# Altium project DB_ADCS.PrjPcb
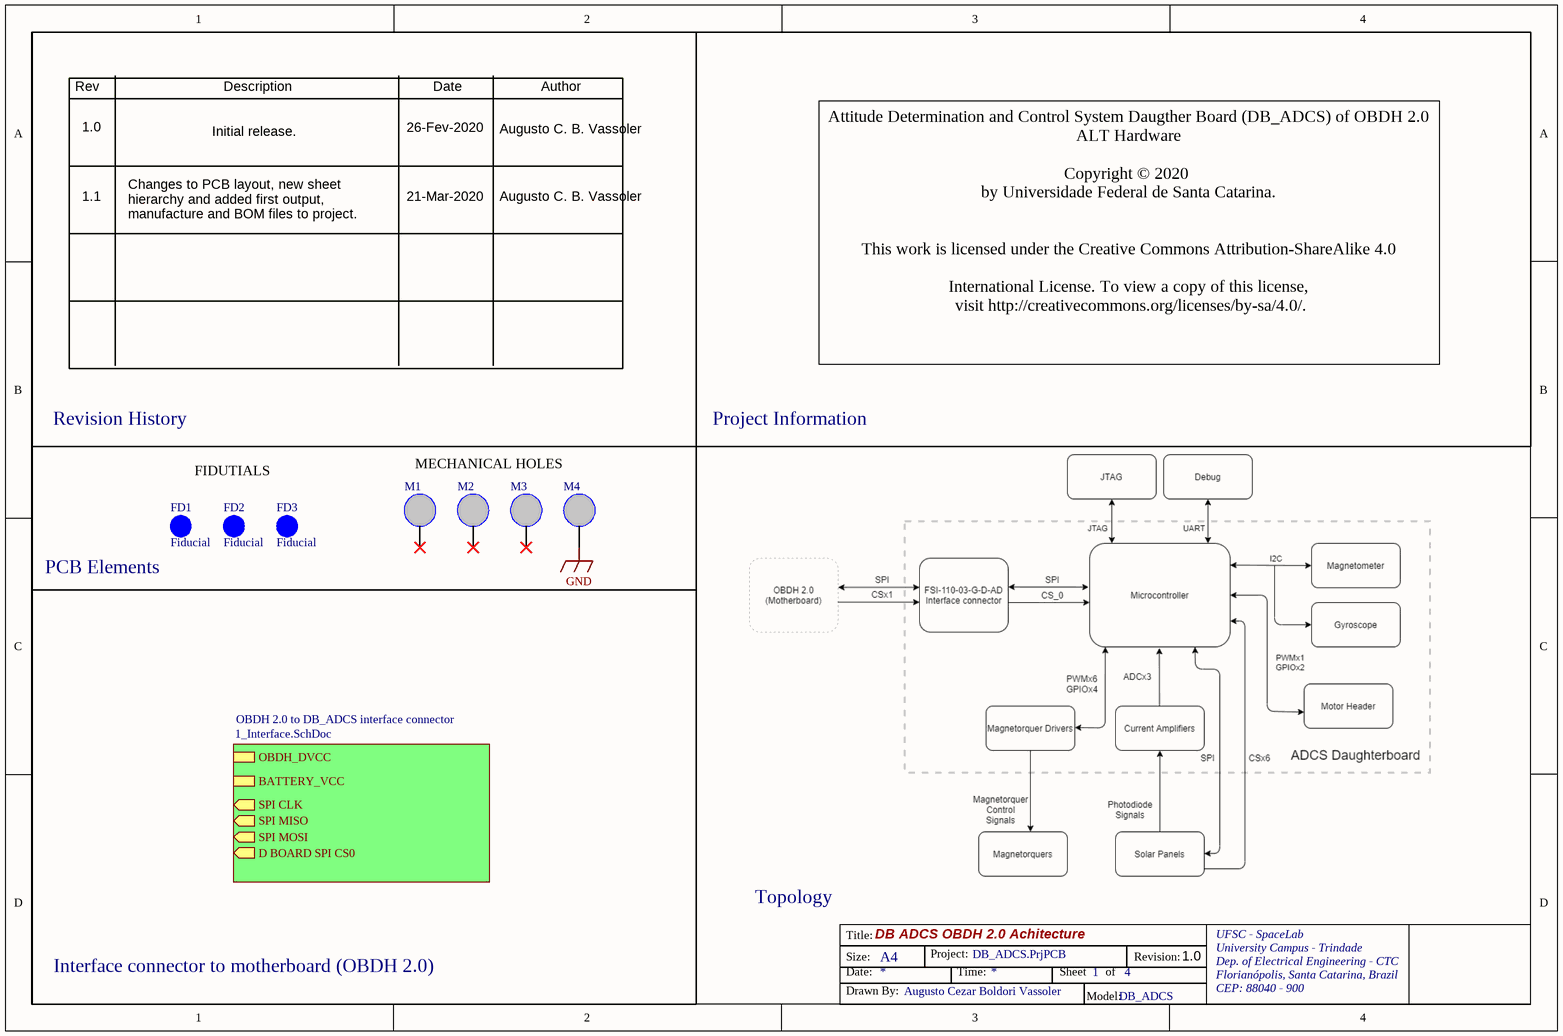
[diagram p0: 0_Architecture.SchDoc]
5 sheets, 84 parts. Net scope: hierarchical (ports join the sheet entries above them; power ports are global).
Board file: DB_ADCS.PcbDoc
Sheets:
  0_Architecture.SchDoc
    OBDH 2.0 to DB_ADCS interface connector = 1_Interface.SchDoc
  4_IMU.SchDoc
  5_Magnetorquer_Drivers.SchDoc
  6_Current_Sensing.SchDoc

## Sheet 0_Architecture.SchDoc
size A4; Organization: SpaceLab UFSC; Address1: UFSC - SpaceLab; Address2: University Campus - Trindade; Address3: Dep. of Electrical Engineering - CTC; Address4: Florianópolis, Santa Catarina, Brazil; Address5: CEP: 88040 - 900

### Parts
FD1  Fiducial  [Fiducial 1.3mm]
FD2  Fiducial  [Fiducial 1.3mm]
FD3  Fiducial  [Fiducial 1.3mm]
M1  DB Mechanical Hole  [DB Mechanical Hole]  (value not drawn)
M2  DB Mechanical Hole  [DB Mechanical Hole]  (value not drawn)
M3  DB Mechanical Hole  [DB Mechanical Hole]  (value not drawn)
M4  DB Mechanical Hole  [DB Mechanical Hole]  (value not drawn)

### Sub-sheets
OBDH 2.0 to DB_ADCS interface connector = 1_Interface.SchDoc: OBDH_DVCC, D BOARD SPI CS0 (out), SPI CLK (out), SPI MISO (out), SPI MOSI (out), BATTERY_VCC

### Nets
GND: M4.0

Not connected (* = marked no-connect by the designer): M1 0*; M2 0*; M3 0*

### Notes on the sheet
- Rev
- Description
- Date
- Author
- 1.0
- Initial release.
- 26-Fev-2020
- Augusto C. B. Vassoler
- 1.1
- Changes to PCB layout, new sheet hierarchy and added first output, manufacture and BOM files to project.
- 21-Mar-2020
- Attitude Determination and Control System Daugther Board (DB_ADCS) of OBDH 2.0 ALT Hardware
  Copyright © 2020
  by Universidade Federal de Santa Catarina.
  This work is licensed under the Creative Commons Attribution-ShareAlike 4.0
  International License. To view a copy of this license,
  visit http://creativecommons.org/licenses/by-sa/4.0/.
  - Drawn by: Augusto Cezar Boldori Vassoler.
  - Reviewers: André Martins Pio de Mattos and Gabriel Mariano Marcelino.
  - Based on OBDH 2.0 designed by: André Martins Pio de Mattos.
- Revision History
- Project Information
- FIDUTIALS
- MECHANICAL HOLES
- (near FD1) PCB Elements
- Topology
- Interface connector to motherboard (OBDH 2.0)
- DB ADCS OBDH 2.0 Achitecture
- DB_ADCS.PrjPCB
- 1
- 4
- Augusto Cezar Boldori Vassoler
- DB_ADCS
- Title:
- Size:
- Date:
- A4
- Project:
- Time:
- Sheet
- of
- Revision:
- UFSC - SpaceLab
- University Campus - Trindade
- Dep. of Electrical Engineering - CTC
- Florianópolis, Santa Catarina, Brazil
- CEP: 88040 - 900
- Drawn By:
- Model:

### Library data of the parts
FD1-FD3 = Fiducial: Fiducial for DB board variants
M1-M4 = DB Mechanical Hole: Mechanical Hole for DB board variants

## Sheet 1_Interface.SchDoc: DB_ADCS Interface
size A3; DrawnBy: Augusto Cezar Boldori Vassoler; Revision: V1.0; SheetNumber: 1; SheetTotal: 6; Project: DB_ADCS.PrjPCB
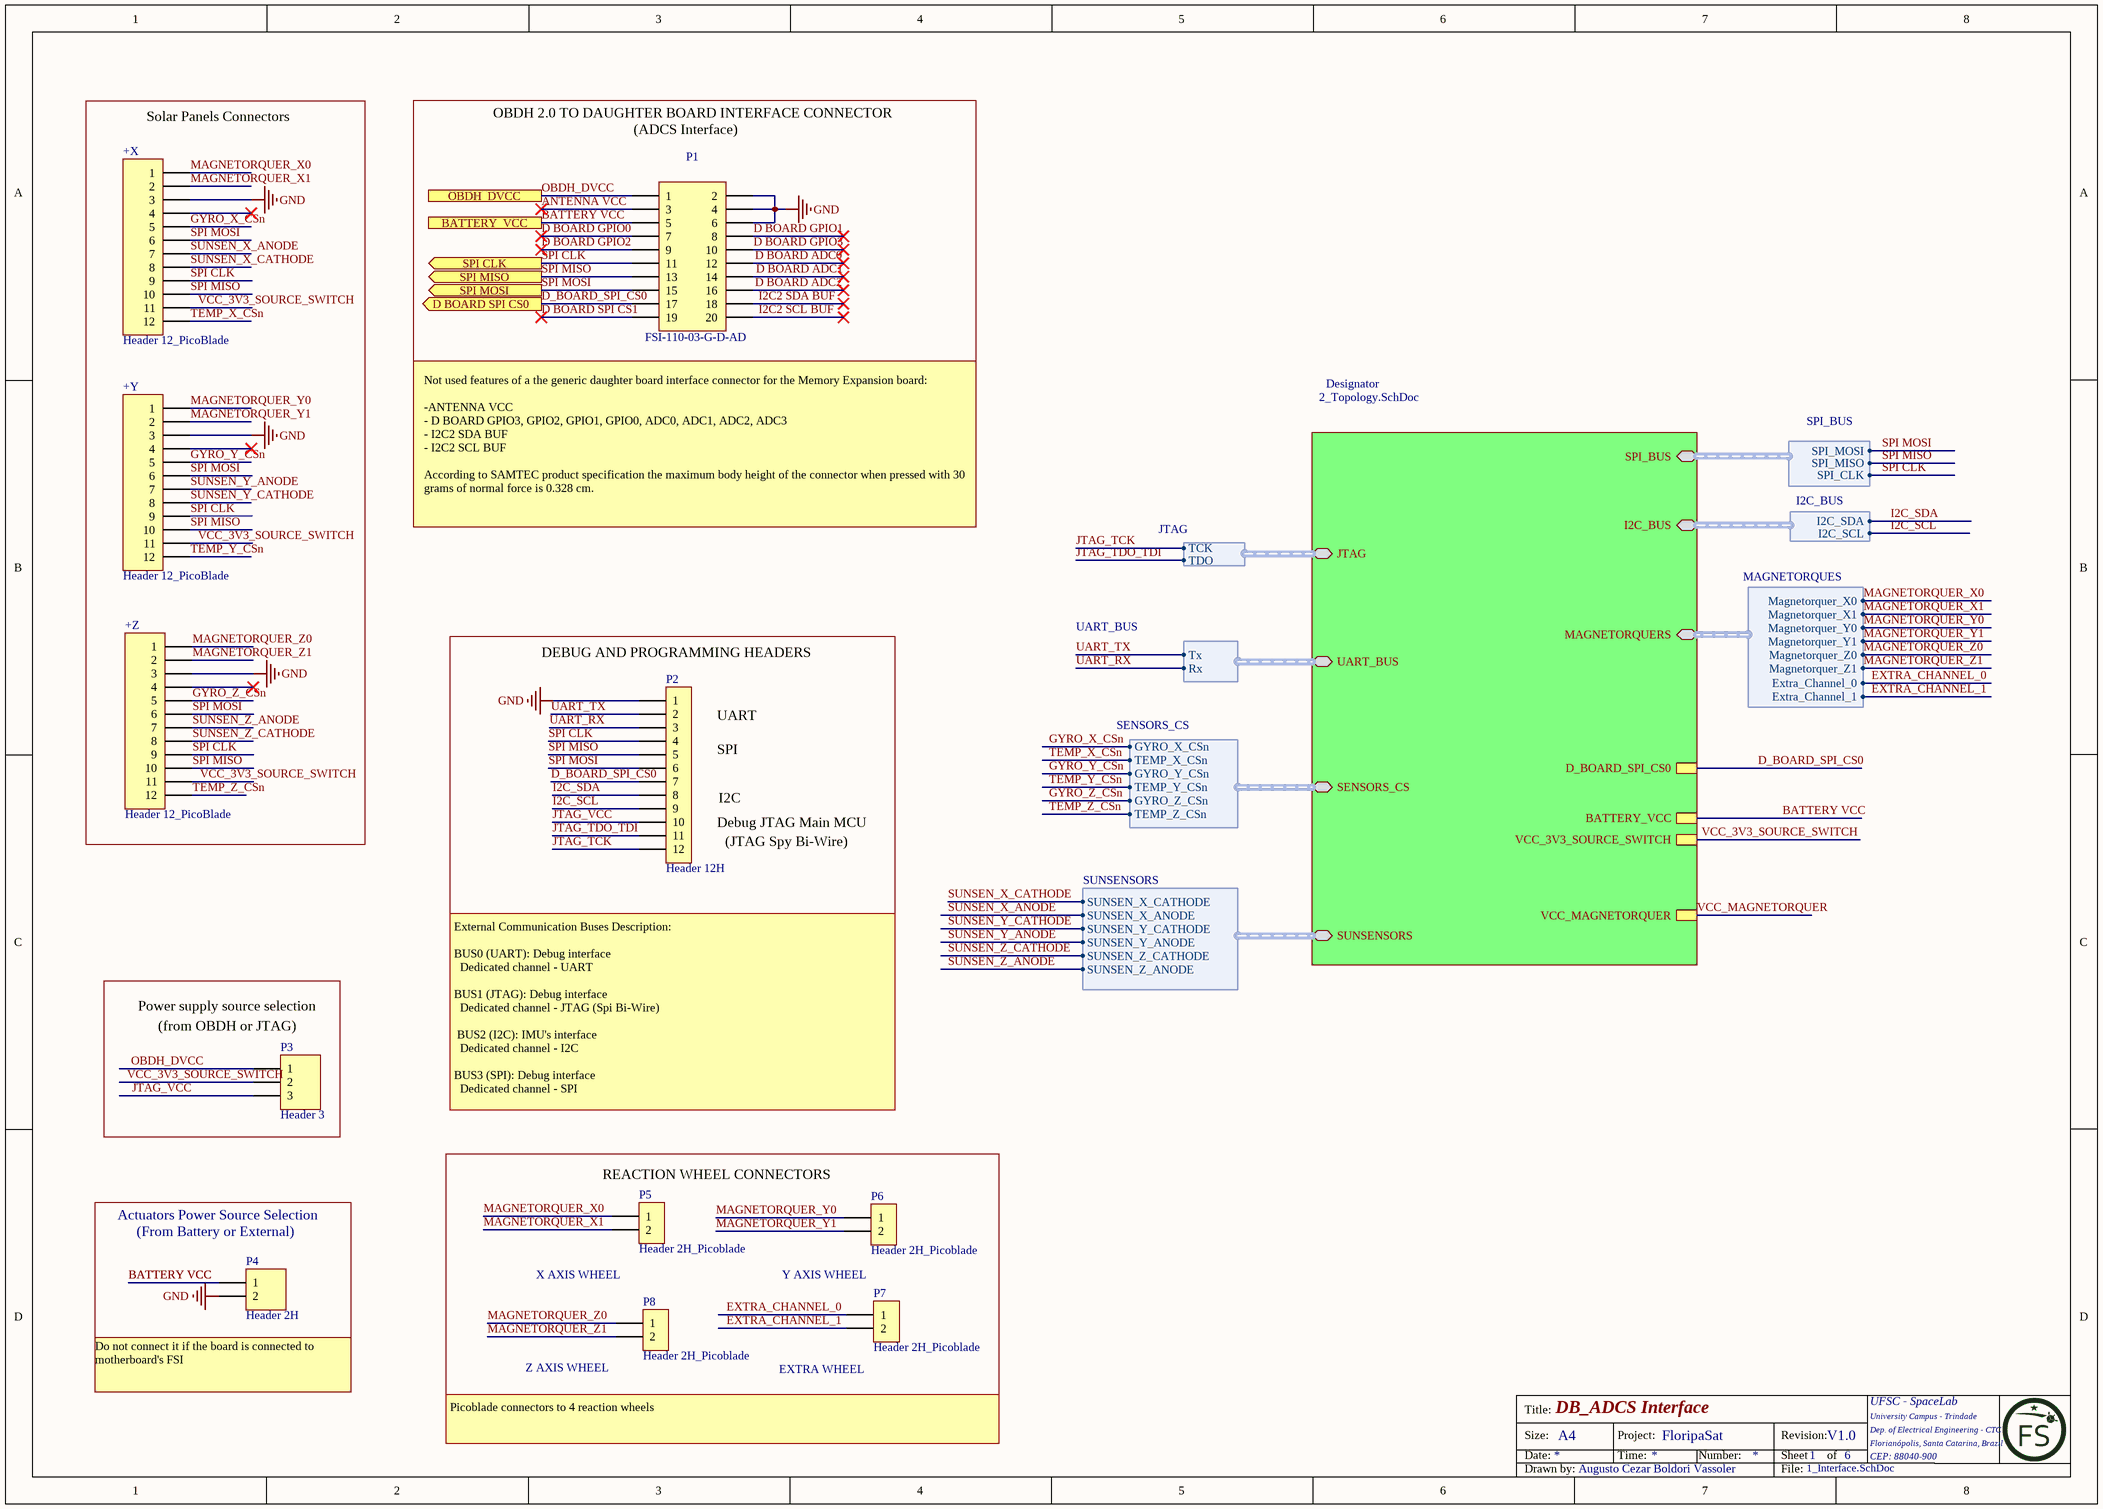
[diagram p1: 1_Interface.SchDoc]

### Parts
+X  Header 12_PicoBlade  [HDR12 PicoBlade - duplicate]
+Y  Header 12_PicoBlade  [HDR12 PicoBlade - duplicate]
+Z  Header 12_PicoBlade  [HDR12 PicoBlade - duplicate]
P1  FSI-110-03-G-D-AD  [Mating FSI-110-03-G-D-AD]
P2  Header 12H  [61301211021]
P3  Header 3  [HDR1X3]
P4  Header 2H  [HDR1X2H]
P5  Header 2H_Picoblade  [HDR2 PICOBLADE]
P6  Header 2H_Picoblade  [HDR2 PICOBLADE]
P7  Header 2H_Picoblade  [HDR2 PICOBLADE]
P8  Header 2H_Picoblade  [HDR2 PICOBLADE]

### Blocks framed on the sheet
Solar Panels Connectors: +X +Y +Z
REACTION WHEEL CONNECTORS: P5-P8

### Sub-sheets
Designator = 2_Topology.SchDoc (file not in this document): JTAG (bidir, harness JTAG), UART_BUS (bidir, harness UART_BUS), SENSORS_CS (bidir, harness SENSORS_CS), SUNSENSORS (bidir, harness SUNSENSORS), MAGNETORQUERS (bidir, harness MAGNETORQUES), BATTERY_VCC, I2C_BUS (bidir, harness I2C_BUS), SPI_BUS (bidir, harness SPI_BUS), VCC_3V3_SOURCE_SWITCH, D_BOARD_SPI_CS0, VCC_MAGNETORQUER

### Ports
BATTERY_VCC, D BOARD SPI CS0 (out), OBDH_DVCC, SPI CLK (out), SPI MISO (out), SPI MOSI (out)

### Harnesses
JTAG: TDO, TCK
UART_BUS: Rx, Tx
SENSORS_CS: GYRO_X_CSn, TEMP_X_CSn, GYRO_Y_CSn, TEMP_Y_CSn, GYRO_Z_CSn, TEMP_Z_CSn
SUNSENSORS: SUNSEN_Z_ANODE, SUNSEN_Z_CATHODE, SUNSEN_Y_ANODE, SUNSEN_Y_CATHODE, SUNSEN_X_ANODE, SUNSEN_X_CATHODE
MAGNETORQUES: Magnetorquer_X0, Magnetorquer_X1, Magnetorquer_Y0, Magnetorquer_Y1, Magnetorquer_Z0, Magnetorquer_Z1, Extra_Channel_0, Extra_Channel_1
I2C_BUS: I2C_SDA, I2C_SCL
SPI_BUS: SPI_CLK, SPI_MISO, SPI_MOSI

### Nets
GND: +X.3 +Y.3 +Z.3 P1.2 P1.4 P1.6 P2.1 P4.2
ANTENNA VCC: P1.3  [project net ANTENNA VCC_1]
BATTERY VCC: P1.5 P4.1 ; port BATTERY_VCC, sheet Designator/BATTERY_VCC
D BOARD ADC0: P1.12  [project net D BOARD ADC0_1]
D BOARD ADC1: P1.14  [project net D BOARD ADC1_1]
D BOARD ADC2: P1.16  [project net D BOARD ADC2_1]
D BOARD GPIO0: P1.7  [project net D BOARD GPIO0_1]
D BOARD GPIO1: P1.8  [project net D BOARD GPIO1_1]
D BOARD GPIO2: P1.9  [project net D BOARD GPIO2_1]
D BOARD GPIO3: P1.10  [project net D BOARD GPIO3_1]
D BOARD SPI CS1: P1.19  [project net D BOARD SPI CS1_1]
D_BOARD_SPI_CS0: P1.17 P2.7 ; port D BOARD SPI CS0, sheet Designator/D_BOARD_SPI_CS0
EXTRA_CHANNEL_0: P7.1 ; sheet Designator/MAGNETORQUERS.Extra_Channel_0
EXTRA_CHANNEL_1: P7.2 ; sheet Designator/MAGNETORQUERS.Extra_Channel_1
GYRO_X_CSn: +X.5 ; sheet Designator/SENSORS_CS.GYRO_X_CSn
GYRO_Y_CSn: +Y.5 ; sheet Designator/SENSORS_CS.GYRO_Y_CSn
GYRO_Z_CSn: +Z.5 ; sheet Designator/SENSORS_CS.GYRO_Z_CSn
I2C2 SCL BUF: P1.20  [project net I2C2 SCL BUF_1]
I2C2 SDA BUF: P1.18  [project net I2C2 SDA BUF_1]
I2C_SCL: P2.9 ; sheet Designator/I2C_BUS.I2C_SCL
I2C_SDA: P2.8 ; sheet Designator/I2C_BUS.I2C_SDA
JTAG_TCK: P2.12 ; sheet Designator/JTAG.TCK
JTAG_TDO_TDI: P2.11 ; sheet Designator/JTAG.TDO
JTAG_VCC: P2.10 P3.3  [project net JTAG_VCC_1]
MAGNETORQUER_X0: +X.1 P5.1 ; sheet Designator/MAGNETORQUERS.Magnetorquer_X0
MAGNETORQUER_X1: +X.2 P5.2 ; sheet Designator/MAGNETORQUERS.Magnetorquer_X1
MAGNETORQUER_Y0: +Y.1 P6.1 ; sheet Designator/MAGNETORQUERS.Magnetorquer_Y0
MAGNETORQUER_Y1: +Y.2 P6.2 ; sheet Designator/MAGNETORQUERS.Magnetorquer_Y1
MAGNETORQUER_Z0: +Z.1 P8.1 ; sheet Designator/MAGNETORQUERS.Magnetorquer_Z0
MAGNETORQUER_Z1: +Z.2 P8.2 ; sheet Designator/MAGNETORQUERS.Magnetorquer_Z1
OBDH_DVCC: P1.1 P3.1 ; port OBDH_DVCC
SPI CLK: +X.9 +Y.9 +Z.9 P1.11 P2.4 ; port SPI CLK, sheet Designator/SPI_BUS.SPI_CLK
SPI MISO: +X.10 +Y.10 +Z.10 P1.13 P2.5 ; port SPI MISO, sheet Designator/SPI_BUS.SPI_MISO
SPI MOSI: +X.6 +Y.6 +Z.6 P1.15 P2.6 ; port SPI MOSI, sheet Designator/SPI_BUS.SPI_MOSI
SUNSEN_X_ANODE: +X.7 ; sheet Designator/SUNSENSORS.SUNSEN_X_ANODE
SUNSEN_X_CATHODE: +X.8 ; sheet Designator/SUNSENSORS.SUNSEN_X_CATHODE
SUNSEN_Y_ANODE: +Y.7 ; sheet Designator/SUNSENSORS.SUNSEN_Y_ANODE
SUNSEN_Y_CATHODE: +Y.8 ; sheet Designator/SUNSENSORS.SUNSEN_Y_CATHODE
SUNSEN_Z_ANODE: +Z.7 ; sheet Designator/SUNSENSORS.SUNSEN_Z_ANODE
SUNSEN_Z_CATHODE: +Z.8 ; sheet Designator/SUNSENSORS.SUNSEN_Z_CATHODE
TEMP_X_CSn: +X.12 ; sheet Designator/SENSORS_CS.TEMP_X_CSn
TEMP_Y_CSn: +Y.12 ; sheet Designator/SENSORS_CS.TEMP_Y_CSn
TEMP_Z_CSn: +Z.12 ; sheet Designator/SENSORS_CS.TEMP_Z_CSn
UART_RX: P2.3 ; sheet Designator/UART_BUS.Rx
UART_TX: P2.2 ; sheet Designator/UART_BUS.Tx
VCC_3V3_SOURCE_SWITCH: +X.11 +Y.11 +Z.11 P3.2 ; sheet Designator/VCC_3V3_SOURCE_SWITCH
VCC_MAGNETORQUER: sheet Designator/VCC_MAGNETORQUER

Not connected (* = marked no-connect by the designer): +X 4*; +Y 4*; +Z 4*

### Notes on the sheet
- OBDH 2.0 TO DAUGHTER BOARD INTERFACE CONNECTOR
- (ADCS Interface)
- Not used features of a the generic daughter board interface connector for the Memory Expansion board:
  -ANTENNA VCC
  - D BOARD GPIO3, GPIO2, GPIO1, GPIO0, ADC0, ADC1, ADC2, ADC3
  - I2C2 SDA BUF
  - I2C2 SCL BUF
  According to SAMTEC product specification the maximum body height of the connector when pressed with 30 grams of normal force is 0.328 cm.
- (near P2) DEBUG AND PROGRAMMING HEADERS
- (near P2) UART
- (near P2) SPI
- (near P2) Debug JTAG Main MCU
- (near P2) I2C
- (JTAG Spy Bi-Wire)
- (near P3) Power supply source selection
- (near P3) (from OBDH or JTAG)
- External Communication Buses Description:
  BUS0 (UART): Debug interface
  Dedicated channel - UART
  BUS1 (JTAG): Debug interface
  Dedicated channel - JTAG (Spi Bi-Wire)
  BUS2 (I2C): IMU's interface
  Dedicated channel - I2C
  BUS3 (SPI): Debug interface
  Dedicated channel - SPI
- Actuators Power Source Selection
- (near P4) (From Battery or External)
- X AXIS WHEEL
- Y AXIS WHEEL
- (near P4) Do not connect it if the board is connected to motherboard's FSI
- (near P8) Z AXIS WHEEL
- (near P7) EXTRA WHEEL
- Picoblade connectors to 4 reaction wheels
- Title:
- Size:
- Date:
- A4
- Project:
- Time:
- FloripaSat
- Number:
- Revision:
- Sheet
- of
- UFSC - SpaceLab
- University Campus - Trindade
- Dep. of Electrical Engineering - CTC
- Florianópolis, Santa Catarina, Brazil
- CEP: 88040-900
- Drawn by:
- File:

### Library data of the parts
+X +Y = Header 12_PicoBlade: Header, 12-Pin; PartNumber: 53398-1271; LatestRevisionDate: 17-Jul-2002; LatestRevisionNote: Re-released for DXP Platform.; Publisher: Altium Limited
+Z = Header 12_PicoBlade: Header, 12-Pin; PartNumber: 533981271; LatestRevisionDate: 17-Jul-2002; LatestRevisionNote: Re-released for DXP Platform.; Publisher: Altium Limited
P1 = FSI-110-03-G-D-AD: CONN STACKING 20POS SMD GOLD; Manufacturer: Samtec; Gender: Male; Number of Contacts: 20; Pitch: 1mm; Value: *; Partnumber: FSI-110-03-G-D-AD; ComponentLink1Description: https://www.digikey.com/product-detail/en/samtec-inc/FSI-110-03-G-D-AD/SAM9412-ND/6678149; ComponentLink1URL: https://www.digikey.com/product-detail/en/samtec-inc/FSI-110-03-G-D-AD/SAM9412-ND/6678149; ComponentLink2Description: https://br.mouser.com/ProductDetail/Samtec/FSI-110-03-G-D-AD?qs=sGAEpiMZZMvffgRu4KC1RxM6nKwEP14AvPoIU%2FGiIRnIunfAN0MvNQ%3D%3D; ComponentLink2URL: https://br.mouser.com/ProductDetail/Samtec/FSI-110-03-G-D-AD?qs=sGAEpiMZZMvffgRu4KC1RxM6nKwEP14AvPoIU%2FGiIRnIunfAN0MvNQ%3D%3D; ComponentLink3Description: http://www.samtec.com/ftppub/pdf/FSI_03.PDF?src-supplier=Avnet+Europe; ComponentLink3URL: http://www.samtec.com/ftppub/pdf/FSI_03.PDF?src-supplier=Avnet+Europe; Contact Material: Copper; Contact Plating: Gold; Manufacturer Part Number: FSI-110-03-G-D-AD; Mount: Surface Mount; Number of Rows: 2; Pricing 1: 1=6.6, 10=6.325, 25=5.7752, 50=5.5, 100=5.225, 250=4.675, 500=4.4, 1000=3.85, 2500=3.6575 (USD); Pricing 2: 1=6.59, 10=5.5, 100=4.68, 250=4.17, 500=3.84, 1000=3.6 (USD); Radiation Hardening: No; REACH SVHC: No SVHC; Stock 1: 100; Stock 2: 50; Supplier 1: Digi-Key; Supplier 2: Mouser; Supplier Part Number 1: SAM9412-ND; Supplier Part Number 2: 200-FSI11003GDAD; Termination: Solder
P2 = Header 12H: Header, 12; Manufacturer: Wurth Electronics; Number of Contacts: 12; Gender: Male; Connector Type: Male Pin; Pitch: 0.1inch; Supplier 1: Digi-Key; Supplier Part Number 1: 732-5343-ND; Manufacturer Part Number: 61301211021; RoHS: Yes; Category: Connectors; Stock 1: 973; Pricing 1: 1=0,90000, 10=0,76600, 25=0,63920, 50=0,53200, 100=0,48400, 500=0,44000 (USD); Mount: Through Hole; Contact Material: Copper; Color: Black; Contact Plating: Gold; Number of Rows: 1; Termination: Solder; Packaging: Bulk; Number of Positions: 12; Contact Mating Length: 0.236inch; REACH SVHC: Unknown; ComponentLink1URL: http://www.farnell.com/datasheets/1442172.pdf?src-supplier=Farnell; ComponentLink1Description: http://www.farnell.com/datasheets/1442172.pdf?src-supplier=Farnell; ComponentLink2URL: http://www.farnell.com/datasheets/1442172.pdf?src-supplier=Element14; ComponentLink2Description: http://www.farnell.com/datasheets/1442172.pdf?src-supplier=Element14; ComponentLink3URL: https://katalog.we-online.de/em/datasheet/6130xx11021.pdf?src-supplier=Digi-Key; ComponentLink3Description: https://katalog.we-online.de/em/datasheet/6130xx11021.pdf?src-supplier=Digi-Key; ComponentLink4URL: http://www.farnell.com/datasheets/1442172.pdf?src-supplier=Newark; ComponentLink4Description: http://www.farnell.com/datasheets/1442172.pdf?src-supplier=Newark
P3 = Header 3: Header, 3-Pin; LatestRevisionDate: 17-Jul-2002; LatestRevisionNote: Re-released for DXP Platform.; Publisher: Altium Limited
P4 = Header 2H: Header, 2-Pin, Right Angle; LatestRevisionDate: 17-Jul-2002; LatestRevisionNote: Re-released for DXP Platform.; Publisher: Altium Limited
P5-P8 = Header 2H_Picoblade: Header,2-Pin,Right Angle; Manufacturer: Molex; Manufacturer Part Number: 53261-0271; Number of Positions: 2; Gender: Male; Current Rating: 1A; Voltage Rating: 125V; Contact Resistance: 20mR; Insulation Resistance: 100MR; Pitch: 1.25mm; Glow Wire Compliant: Non-compliant; Supplier 1: Digi-Key; Supplier Part Number 1: WM7620CT-ND; RoHS: Yes; Category: Headers and Wire Housings; Stock 1: 38296; Pricing 1: 1=0,51000, 10=0,48200, 100=0,36940, 500=0,32120 (USD); Mount: Surface Mount; Housing Material: Thermoplastic; Contact Material: Bronze,Tin; Color: Beige; Contact Plating: Tin; Min Operating Temperature: -40°C; Max Operating Temperature: 85°C; Termination: SMD/SMT; Packaging: Tape and Reel; Number of Rows: 1; Package Quantity: 1000; Orientation: Right Angle; Number of Contacts: 2; Number of Circuits: 2; Voltage Rating (DC): 125V; Voltage Rating (AC): 125V; Working Voltage: 125V; Lead Pitch: 1.25mm; Radiation Hardening: No; REACH SVHC: Unknown; Lead Free: Lead Free; Flammability Rating: UL94 V-0; ComponentLink1URL: https://datasheet.ciiva.com/11747/0900766b8078fc90-11747475.pdf?src-supplier=RSComponents; ComponentLink1Description: https://datasheet.ciiva.com/11747/0900766b8078fc90-11747475.pdf?src-supplier=RSComponents; ComponentLink2URL: https://datasheet.ciiva.com/7167/1626147-7167496.pdf?src-supplier=Newark; ComponentLink2Description: https://datasheet.ciiva.com/7167/1626147-7167496.pdf?src-supplier=Newark; ComponentLink3URL: https://datasheet.ciiva.com/30193/198270532610271-pcb-headers-30193321.pdf?src-supplier=Onlinecomponents.com; ComponentLink3Description: https://datasheet.ciiva.com/30193/198270532610271-pcb-headers-30193321.pdf?src-supplier=Onlinecomponents.com; ComponentLink4URL: https://datasheet.ciiva.com/5151/0532610271-pcb-headers-171053-5151611.pdf?src-supplier=Mouser; ComponentLink4Description: https://datasheet.ciiva.com/5151/0532610271-pcb-headers-171053-5151611.pdf?src-supplier=Mouser; ComponentLink5URL: https://datasheet.ciiva.com/34303/1932547-34303342.pdf?src-supplier=Jameco; ComponentLink5Description: https://datasheet.ciiva.com/34303/1932547-34303342.pdf?src-supplier=Jameco; ComponentLink6URL: https://datasheet.ciiva.com/16658/0532610271-pcb-headers-16658423.pdf?src-supplier=Avnet+Europe; ComponentLink6Description: https://datasheet.ciiva.com/16658/0532610271-pcb-headers-16658423.pdf?src-supplier=Avnet+Europe; ComponentLink7URL: https://datasheet.ciiva.com/17035/70091115-17035863.pdf?src-supplier=Allied+Electronics; ComponentLink7Description: https://datasheet.ciiva.com/17035/70091115-17035863.pdf?src-supplier=Allied+Electronics; ComponentLink8URL: https://datasheet.ciiva.com/7920/1887027-7920826.pdf?src-supplier=Element14; ComponentLink8Description: https://datasheet.ciiva.com/7920/1887027-7920826.pdf?src-supplier=Element14; ComponentLink9URL: https://datasheet.ciiva.com/9468/0532610271-pcb-headers-9468506.pdf?src-supplier=Avnet; ComponentLink9Description: https://datasheet.ciiva.com/9468/0532610271-pcb-headers-9468506.pdf?src-supplier=Avnet; ComponentLink10URL: https://datasheet.ciiva.com/22683/1626147-22683562.pdf?src-supplier=Element14; ComponentLink10Description: https://datasheet.ciiva.com/22683/1626147-22683562.pdf?src-supplier=Element14; ComponentLink11URL: https://datasheet.ciiva.com/46393/1808526-46393547.pdf?src-supplier=Element14; ComponentLink11Description: https://datasheet.ciiva.com/46393/1808526-46393547.pdf?src-supplier=Element14

## Sheet 4_IMU.SchDoc: DB_ADCS IMU
size A4; DrawnBy: Augusto Cezar Boldori Vassoler; Revision: V1.0; SheetNumber: 4; SheetTotal: 7
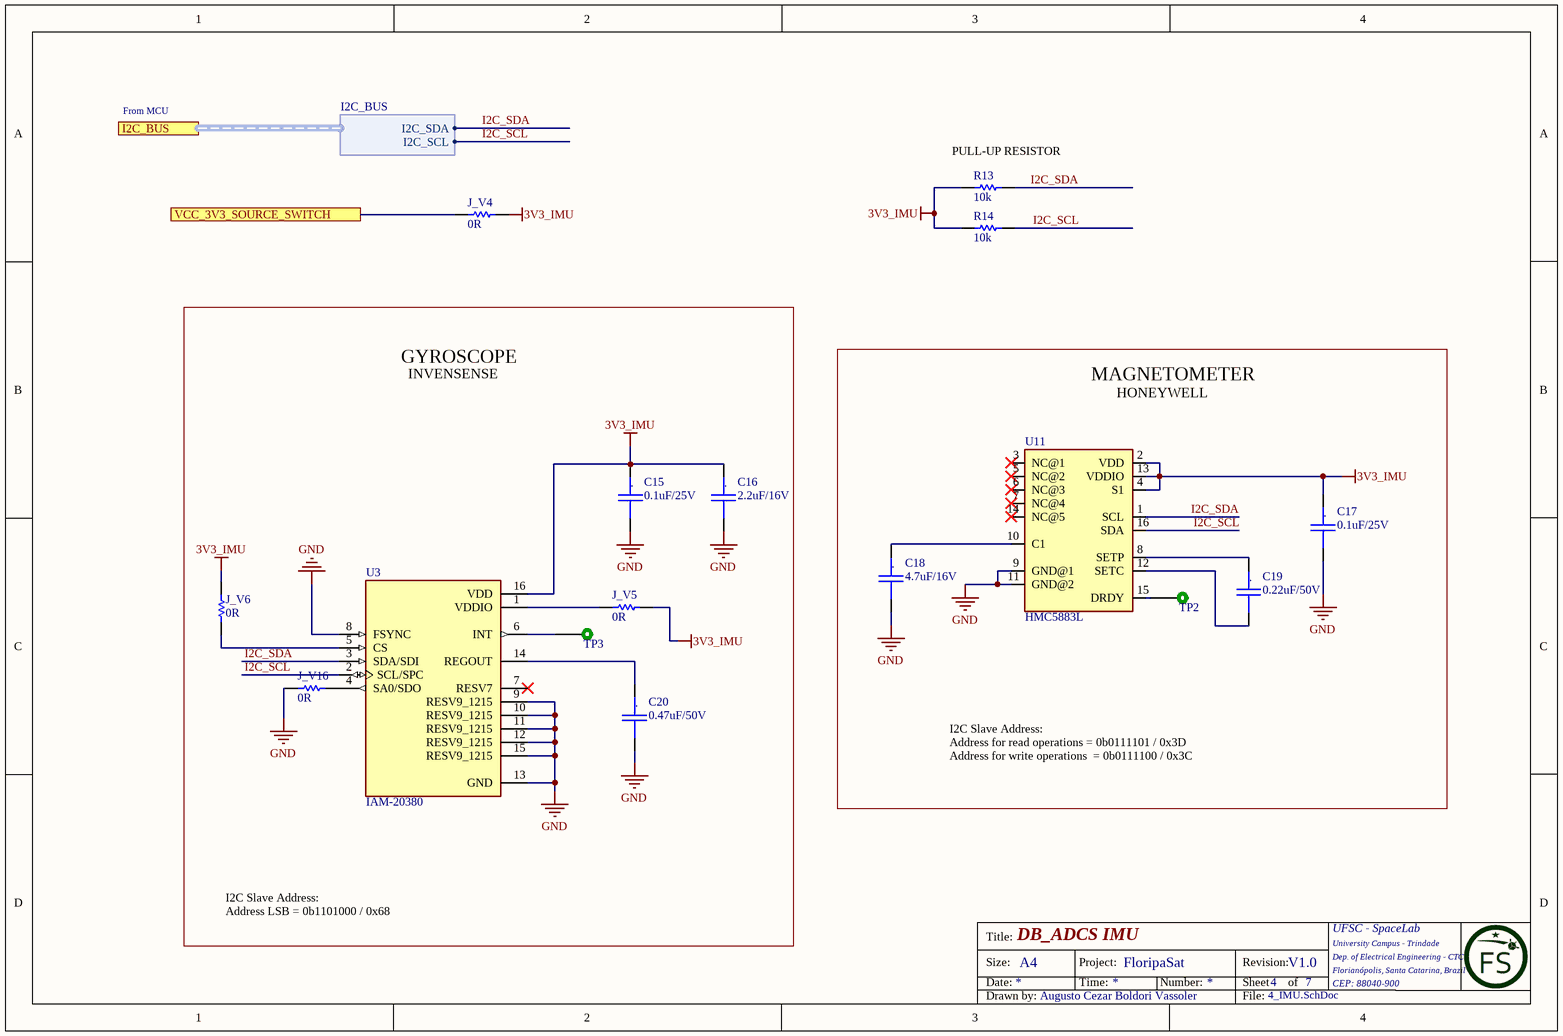
[diagram p2: 4_IMU.SchDoc]

### Parts
C15  0.1uF/25V  [CC0805]
C16  2.2uF/16V  [CC0805]
C17  0.1uF/25V  [CC0805]
C18  4.7uF/16V  [CC0805]
C19  0.22uF/50V  [CC0805]
C20  0.47uF/50V  [CC0805]
J_V4  0R  [0805-LED]
J_V5  0R  [0805-LED]
J_V6  0R  [0805-LED]
J_V16  0R  [0805-LED]
R13  10k  [0805]
R14  10k  [0805]
TP2  TEST_POINT_2  [TEST_POINT_2]  (value not drawn)  (no BOM)
TP3  TEST_POINT_2  [TEST_POINT_2]  (value not drawn)  (no BOM)
U3  IAM-20380  [PQFN50P300X300X80-16N]
U11  HMC5883L  [LPCC-16]

### Blocks framed on the sheet
GYROSCOPE: C15 C16 C20 J_V5 J_V6 J_V16 TP3 U3
MAGNETOMETER: C17-C19 TP2 U11

### Ports
I2C_BUS (harness I2C_BUS), VCC_3V3_SOURCE_SWITCH

### Harnesses
I2C_BUS: I2C_SCL, I2C_SDA

### Nets
3V3_IMU: C15.1 C16.1 C17.1 J_V4.1 J_V5.1 J_V6.2 R13.2 R14.2 U3.16(VDD) U11.2(VDD) U11.4(S1) U11.13(VDDIO)
GND: C15.2 C16.2 C17.2 C18.2 C20.2 J_V16.2 U3.8(FSYNC) U3.9(RESV9_1215) U3.10(RESV9_1215) U3.11(RESV9_1215) U3.12(RESV9_1215) U3.13(GND) U3.15(RESV9_1215) U11.9(GND@1) U11.11(GND@2)
I2C_SCL: R14.1 U3.2(SCL/SPC) U11.16(SDA) ; port I2C_BUS.I2C_SCL
I2C_SDA: R13.1 U3.3(SDA/SDI) U11.1(SCL) ; port I2C_BUS.I2C_SDA
VCC_3V3_SOURCE_SWITCH: J_V4.2 ; port VCC_3V3_SOURCE_SWITCH
NetC18_1: C18.1 U11.10(C1)
NetC19_1: C19.1 U11.8(SETP)
NetC19_2: C19.2 U11.12(SETC)
NetC20_1: C20.1 U3.14(REGOUT)
NetJ_V5_2: J_V5.2 U3.1(VDDIO)
NetJ_V6_1: J_V6.1 U3.5(CS)
NetJ_V16_1: J_V16.1 U3.4(SA0/SDO)
NetTP2_1: TP2.1 U11.15(DRDY)
NetTP3_1: TP3.1 U3.6(INT)

Not connected (* = marked no-connect by the designer): U3 7(RESV7)*; U11 3(NC@1)* 5(NC@2)* 6(NC@3)* 7(NC@4)* 14(NC@5)*

### Notes on the sheet
- From MCU
- (near R13) PULL-UP RESISTOR
- INVENSENSE
- HONEYWELL
- I2C Slave Address:
  Address for read operations = 0b0111101 / 0x3D
  Address for write operations  = 0b0111100 / 0x3C
- I2C Slave Address:
  Address LSB = 0b1101000 / 0x68
- Title:
- Size:
- Date:
- A4
- Project:
- Time:
- FloripaSat
- Number:
- Revision:
- Sheet
- of
- UFSC - SpaceLab
- University Campus - Trindade
- Dep. of Electrical Engineering - CTC
- Florianópolis, Santa Catarina, Brazil
- CEP: 88040-900
- Drawn by:
- File:
- (in symbol Cap_Cer_X7R_0.1uF_25V_0805) .
- (in symbol Cap_Cer_X7R_0.22uF_0805) .
- (in symbol Cap_Cer_X7R_0.47uF_50V_0805) .
- (in symbol Cap_Cer_X7R_2.2uF_16V_0805) .
- (in symbol Cap_Cer_X7R_4.7uF_16V_0805) .

### Library data of the parts
C15 C17 = Cap_Cer_X7R_0.1uF_25V_0805: CAP CER 0.1UF 25V 10% X7R 0805; Partnumber: CC0805KRX7R8BB104; NCM: 8532.24.10
C16 = Cap_Cer_X7R_2.2uF_16V_0805: CAP CER 2.2uF 16V 0805; Partnumber: C2012X7R1C225K125AB; NCM: 8532.24.10
C18 = Cap_Cer_X7R_4.7uF_16V_0805: Cap Ceramic 4.7uF 16V X7R 10% SMD 0805 125C Embossed T/R; Manufacturer: Kyocera AVX; Manufacturer Part Number: 0805YC475KAT2A; Voltage: 10V; Dissipation Factor: 3.5%; Supplier 1: Digi-Key; Supplier Part Number 1: 478-5722-1-ND; RoHS: Yes; Category: Ceramic Capacitors; Stock 1: 183899; Pricing 1: 1=0,51000, 10=0,36300, 100=0,23910, 500=0,17710, 1000=0,15054 (USD); Mount: Surface Mount; Case/Package: 0805; Number of Pins: 2; Case Code (Metric): 2012; Case Code (Imperial): 0805; Contact Plating: Tin,Matte; Min Operating Temperature: -55°C; Max Operating Temperature: 125°C; Capacitance: 4.7uF; Tolerance: 10%; Packaging: Tape and Reel; Voltage Rating (DC): 16V; Termination: SMD/SMT; Package Quantity: 1; Voltage Rating: 16V; Dielectric: X7R; Length: 2.01mm; Height: 1.52mm; Width: 0.049inch; Thickness: 0.06inch; Depth: 1.25mm; Radiation Hardening: No; REACH SVHC: No SVHC; Lead Free: Lead Free; ComponentLink1URL: https://datasheet.ciiva.com/11787/0900766b80dc2409-11787157.pdf?src-supplier=RSComponents; ComponentLink1Description: https://datasheet.ciiva.com/11787/0900766b80dc2409-11787157.pdf?src-supplier=RSComponents; ComponentLink2URL: https://datasheet.ciiva.com/154/cx7r-154080.pdf?src-supplier=Digi-Key; ComponentLink2Description: https://datasheet.ciiva.com/154/cx7r-154080.pdf?src-supplier=Digi-Key; ComponentLink3URL: https://datasheet.ciiva.com/154/cx7r-154081.pdf?src-supplier=Digi-Key; ComponentLink3Description: https://datasheet.ciiva.com/154/cx7r-154081.pdf?src-supplier=Digi-Key; ComponentLink4URL: https://datasheet.ciiva.com/7812/cx7r-7812213.pdf?src-supplier=Element14; ComponentLink4Description: https://datasheet.ciiva.com/7812/cx7r-7812213.pdf?src-supplier=Element14; ComponentLink5URL: https://datasheet.ciiva.com/7812/cx7r-7812214.pdf?src-supplier=Element14; ComponentLink5Description: https://datasheet.ciiva.com/7812/cx7r-7812214.pdf?src-supplier=Element14; ComponentLink6URL: https://datasheet.ciiva.com/5414/cx7r-218113-5414810.pdf?src-supplier=Mouser; ComponentLink6Description: https://datasheet.ciiva.com/5414/cx7r-218113-5414810.pdf?src-supplier=Mouser; ComponentLink7URL: https://datasheet.ciiva.com/2988/cx7r-2988060.pdf?src-supplier=Avnet; ComponentLink7Description: https://datasheet.ciiva.com/2988/cx7r-2988060.pdf?src-supplier=Avnet; ComponentLink8URL: https://datasheet.ciiva.com/16389/cx7r-16389021.pdf?src-supplier=Future+Electronics; ComponentLink8Description: https://datasheet.ciiva.com/16389/cx7r-16389021.pdf?src-supplier=Future+Electronics; ComponentLink9URL: https://datasheet.ciiva.com/154/cx7r-154079.pdf?src-supplier=Digi-Key; ComponentLink9Description: https://datasheet.ciiva.com/154/cx7r-154079.pdf?src-supplier=Digi-Key; ComponentLink10URL: https://datasheet.ciiva.com/11570/cx7r-11570847.pdf?src-supplier=Avnet; ComponentLink10Description: https://datasheet.ciiva.com/11570/cx7r-11570847.pdf?src-supplier=Avnet
C19 = Cap_Cer_X7R_0.22uF_0805: CAP CER 0.22UF 50V X7R 0805; Manufacturer: KEMET; Manufacturer Part Number: C0805C224K5RACTU; Dielectric Material: Ceramic; Capacitance: 220nF; Tolerance: 10%; Dissipation Factor: 2.5%; Supplier 1: Digi-Key; Supplier Part Number 1: 399-3491-1-ND; RoHS: Yes; Category: Ceramic Capacitors; Stock 1: 1491563; Pricing 1: 1=0,20000, 10=0,13900, 100=0,06550, 500=0,04592, 1000=0,03802 (USD); Mount: Surface Mount,PCB; Case/Package: 0805; Case Code (Metric): 2012; Case Code (Imperial): 0805; Min Operating Temperature: -55°C; Max Operating Temperature: 125°C; Packaging: Tape and Reel; Dielectric: X7R; Package Quantity: 1; Voltage Rating: 50V; Voltage Rating (DC): 50V; Termination: SMD/SMT; Voltage: 50V; Length: 2mm; Height: 1.1mm; Depth: 1.25mm; Width: 0.049inch; Thickness: 0.055inch; Lead Pitch: 0.75mm; Radiation Hardening: No; REACH SVHC: No SVHC; ComponentLink1URL: https://datasheet.ciiva.com/7842/kem-c1002-x7r-smd-7842582.pdf?src-supplier=Element14; ComponentLink1Description: https://datasheet.ciiva.com/7842/kem-c1002-x7r-smd-7842582.pdf?src-supplier=Element14; ComponentLink2URL: https://datasheet.ciiva.com/18193/getdatasheetpartid-304413-18193686.pdf?src-supplier=Verical; ComponentLink2Description: https://datasheet.ciiva.com/18193/getdatasheetpartid-304413-18193686.pdf?src-supplier=Verical; ComponentLink3URL: https://datasheet.ciiva.com/14589/70095383-14589519.pdf?src-supplier=Allied+Electronics; ComponentLink3Description: https://datasheet.ciiva.com/14589/70095383-14589519.pdf?src-supplier=Allied+Electronics; ComponentLink4URL: https://datasheet.ciiva.com/14603/70095383-14603247.pdf?src-supplier=Allied+Electronics; ComponentLink4Description: https://datasheet.ciiva.com/14603/70095383-14603247.pdf?src-supplier=Allied+Electronics; ComponentLink5URL: https://datasheet.ciiva.com/28682/1851736-28682316.pdf?src-supplier=Element14; ComponentLink5Description: https://datasheet.ciiva.com/28682/1851736-28682316.pdf?src-supplier=Element14
C20 = Cap_Cer_X7R_0.47uF_50V_0805: CAP CER 0.47UF 50V 10% X7R 0805; Partnumber: C0805C474K5RACTU; NCM: 8532.24.10
J_V4-J_V6 J_V16 = R0R_JUMPER_1/16W_0805: RES 0R OHM 1/16W JUMPER 0805; Partnumber: CRCW08050000Z0EA; NCM: 8533.21.20
R13 R14 = R10k_1%_1/8W_0805: RES 10K OHM 1/8W 1%  0805; Partnumber: CRCW080510K0FKEA; NCM: 8533.21.20
TP2 TP3 = TEST_POINT_2: Test point
U3 = IAM-20380: Gyroscope X _Pitch_, Y _Roll_, Z _Yaw_ Â±250, 500, 1000, 2000 27kHz IÂ²C, SPI 16-LGA _3x3_; MF: TDK InvenSense; Value: *; SnapEDA_Link: https://www.snapeda.com/parts/IAM-20380/TDK%20InvenSense/view-part/2757130/?ref=snap; Package: PQFN-16 TDK-InvenSense; MP: IAM-20380; Price: None; Availability: Unavailable
U11 = HMC5883L: Magnetoresistive Sensor X, Y, Z Axis 16-LCC; MF: Honeywell; MP: HMC5883L-T; Price: None; Package: LCC-16 Honeywell; SnapEDA_Link: https://www.snapeda.com/parts/HMC5883L-T/Honeywell/view-part/4349541/?ref=snap; Value: *; Availability: Unavailable

## Sheet 5_Magnetorquer_Drivers.SchDoc: DB_ADCS Magnetorquer Drivers
size A4; DrawnBy: Augusto Cezar Boldori Vassoler; Revision: V2.1; SheetNumber: 6; SheetTotal: 7
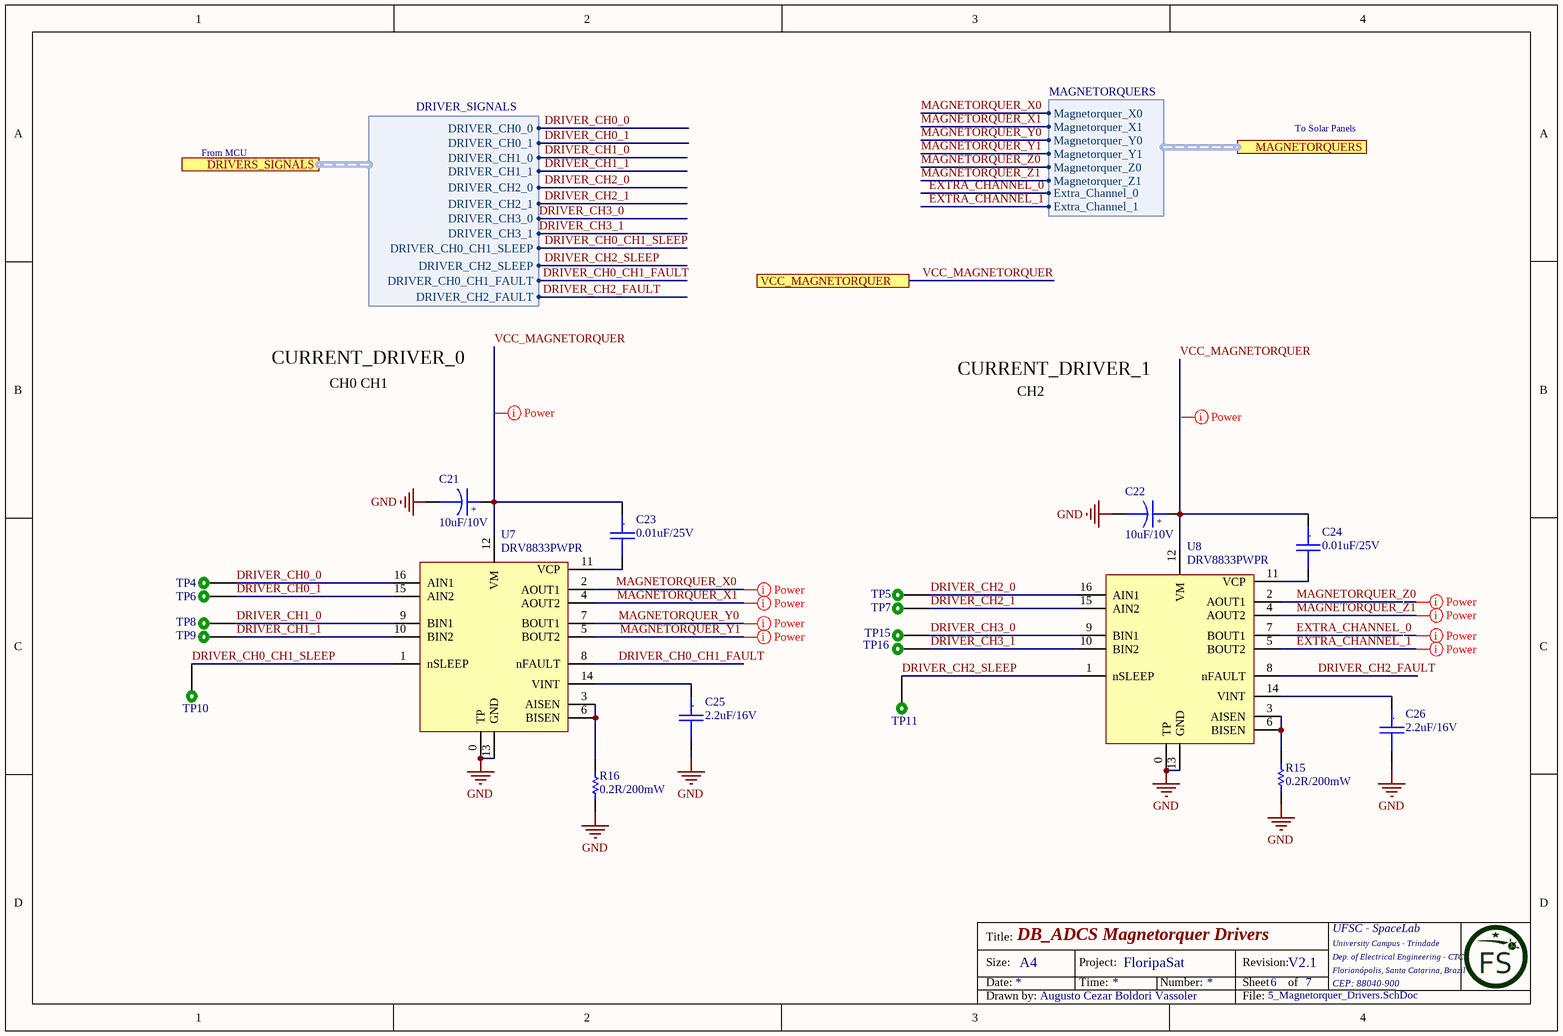
[diagram p3: 5_Magnetorquer_Drivers.SchDoc]

### Parts
C21  10uF/10V  [CC0805_Tantalum]
C22  10uF/10V  [CC0805_Tantalum]
C23  0.01uF/25V  [CC0805]
C24  0.01uF/25V  [CC0805]
C25  2.2uF/16V  [CC0805]
C26  2.2uF/16V  [CC0805]
R15  0.2R/200mW  [0805-LED]
R16  0.2R/200mW  [0805-LED]
TP4  TEST_POINT_2  [TEST_POINT_2]  (value not drawn)  (no BOM)
TP5  TEST_POINT_2  [TEST_POINT_2]  (value not drawn)  (no BOM)
TP6  TEST_POINT_2  [TEST_POINT_2]  (value not drawn)  (no BOM)
TP7  TEST_POINT_2  [TEST_POINT_2]  (value not drawn)  (no BOM)
TP8  TEST_POINT_2  [TEST_POINT_2]  (value not drawn)  (no BOM)
TP9  TEST_POINT_2  [TEST_POINT_2]  (value not drawn)  (no BOM)
TP10  TEST_POINT_2  [TEST_POINT_2]  (value not drawn)  (no BOM)
TP11  TEST_POINT_2  [TEST_POINT_2]  (value not drawn)  (no BOM)
TP15  TEST_POINT_2  [TEST_POINT_2]  (value not drawn)  (no BOM)
TP16  TEST_POINT_2  [TEST_POINT_2]  (value not drawn)  (no BOM)
U7  DRV8833PWPR  [16TTSSOP]
U8  DRV8833PWPR  [16TTSSOP]

### Ports
DRIVERS_SIGNALS (harness DRIVER_SIGNALS), MAGNETORQUERS (harness MAGNETORQUERS), VCC_MAGNETORQUER

### Harnesses
MAGNETORQUERS: Magnetorquer_X0, Magnetorquer_X1, Magnetorquer_Y0, Magnetorquer_Y1, Magnetorquer_Z0, Magnetorquer_Z1, Extra_Channel_0, Extra_Channel_1
DRIVER_SIGNALS: DRIVER_CH1_1, DRIVER_CH1_0, DRIVER_CH0_1, DRIVER_CH0_0, DRIVER_CH2_0, DRIVER_CH2_1, DRIVER_CH0_CH1_SLEEP, DRIVER_CH2_SLEEP, DRIVER_CH0_CH1_FAULT, DRIVER_CH2_FAULT, DRIVER_CH3_0, DRIVER_CH3_1

### Nets
GND: C21.2 C22.2 C25.2 C26.2 R15.1 R16.1 U7.0(TP) U7.13(GND) U8.0(TP) U8.13(GND)
DRIVER_CH0_0: TP4.1 U7.16(AIN1) ; port DRIVERS_SIGNALS.DRIVER_CH0_0
DRIVER_CH0_1: TP6.1 U7.15(AIN2) ; port DRIVERS_SIGNALS.DRIVER_CH0_1
DRIVER_CH0_CH1_FAULT: U7.8(nFAULT) ; port DRIVERS_SIGNALS.DRIVER_CH0_CH1_FAULT
DRIVER_CH0_CH1_SLEEP: TP10.1 U7.1(nSLEEP) ; port DRIVERS_SIGNALS.DRIVER_CH0_CH1_SLEEP
DRIVER_CH1_0: TP8.1 U7.9(BIN1) ; port DRIVERS_SIGNALS.DRIVER_CH1_0
DRIVER_CH1_1: TP9.1 U7.10(BIN2) ; port DRIVERS_SIGNALS.DRIVER_CH1_1
DRIVER_CH2_0: TP5.1 U8.16(AIN1) ; port DRIVERS_SIGNALS.DRIVER_CH2_0
DRIVER_CH2_1: TP7.1 U8.15(AIN2) ; port DRIVERS_SIGNALS.DRIVER_CH2_1
DRIVER_CH2_FAULT: U8.8(nFAULT) ; port DRIVERS_SIGNALS.DRIVER_CH2_FAULT
DRIVER_CH2_SLEEP: TP11.1 U8.1(nSLEEP) ; port DRIVERS_SIGNALS.DRIVER_CH2_SLEEP
DRIVER_CH3_0: TP15.1 U8.9(BIN1) ; port DRIVERS_SIGNALS.DRIVER_CH3_0
DRIVER_CH3_1: TP16.1 U8.10(BIN2) ; port DRIVERS_SIGNALS.DRIVER_CH3_1
EXTRA_CHANNEL_0: U8.7(BOUT1) ; port MAGNETORQUERS.Extra_Channel_0
EXTRA_CHANNEL_1: U8.5(BOUT2) ; port MAGNETORQUERS.Extra_Channel_1
MAGNETORQUER_X0: U7.2(AOUT1) ; port MAGNETORQUERS.Magnetorquer_X0
MAGNETORQUER_X1: U7.4(AOUT2) ; port MAGNETORQUERS.Magnetorquer_X1
MAGNETORQUER_Y0: U7.7(BOUT1) ; port MAGNETORQUERS.Magnetorquer_Y0
MAGNETORQUER_Y1: U7.5(BOUT2) ; port MAGNETORQUERS.Magnetorquer_Y1
MAGNETORQUER_Z0: U8.2(AOUT1) ; port MAGNETORQUERS.Magnetorquer_Z0
MAGNETORQUER_Z1: U8.4(AOUT2) ; port MAGNETORQUERS.Magnetorquer_Z1
VCC_MAGNETORQUER: C21.1 C22.1 C23.1 C24.1 U7.12(VM) U8.12(VM) ; port VCC_MAGNETORQUER
NetC23_2: C23.2 U7.11(VCP)
NetC24_2: C24.2 U8.11(VCP)
NetC25_1: C25.1 U7.14(VINT)
NetC26_1: C26.1 U8.14(VINT)
NetR15_2: R15.2 U8.3(AISEN) U8.6(BISEN)
NetR16_2: R16.2 U7.3(AISEN) U7.6(BISEN)

### Layout directives
net class Power: (no net found under the mark), EXTRA_CHANNEL_1, MAGNETORQUER_X0, MAGNETORQUER_X1, MAGNETORQUER_Y0, MAGNETORQUER_Y1, MAGNETORQUER_Z1, VCC_MAGNETORQUER

### Notes on the sheet
- From MCU
- To Solar Panels
- CURRENT_DRIVER_0
- CURRENT_DRIVER_1
- CH0 CH1
- CH2
- Title:
- Size:
- Date:
- A4
- Project:
- Time:
- FloripaSat
- Number:
- Revision:
- Sheet
- of
- UFSC - SpaceLab
- University Campus - Trindade
- Dep. of Electrical Engineering - CTC
- Florianópolis, Santa Catarina, Brazil
- CEP: 88040-900
- Drawn by:
- File:
- (in symbol Cap_Cer_X7R_0.01uF_50V_0805) .
- (in symbol Cap_Cer_X7R_2.2uF_16V_0805) .
- (in symbol Cap_Tant_SMD_10uF_6V3_0805) +

### Library data of the parts
C21 C22 = Cap_Tant_SMD_10uF_6V3_0805: CAP Tantalum 10uF 6.3V 10% 0805; Partnumber: TPSR106K006R1000; NCM: 8532.21.11
C23 C24 = Cap_Cer_X7R_0.01uF_50V_0805: CAP CER 0.01uF 25V 10% X7R 0805; Partnumber: CL21B103KAANNNC; NCM: 8532.24.10
C25 C26 = Cap_Cer_X7R_2.2uF_16V_0805: as C16 on sheet 4_IMU; NCM: 8532.24.10
R15 R16 = R0.015R_1%_0.5W_0805: RES 0.2 OHM - 0.2W 1% 0805; Partnumber: RL1220S-R20-F; NCM: 8533.21.20
TP4-TP11 TP15 TP16 = TEST_POINT_2: Test point
U7 U8 = DRV8833PWPR: Partnumber: DRV8833PWPR

## Sheet 6_Current_Sensing.SchDoc: DB_ADCS Current Sensing
size A4; DrawnBy: Augusto Cezar Boldori Vassoler; Revision: V2.1; SheetNumber: 7; SheetTotal: 7
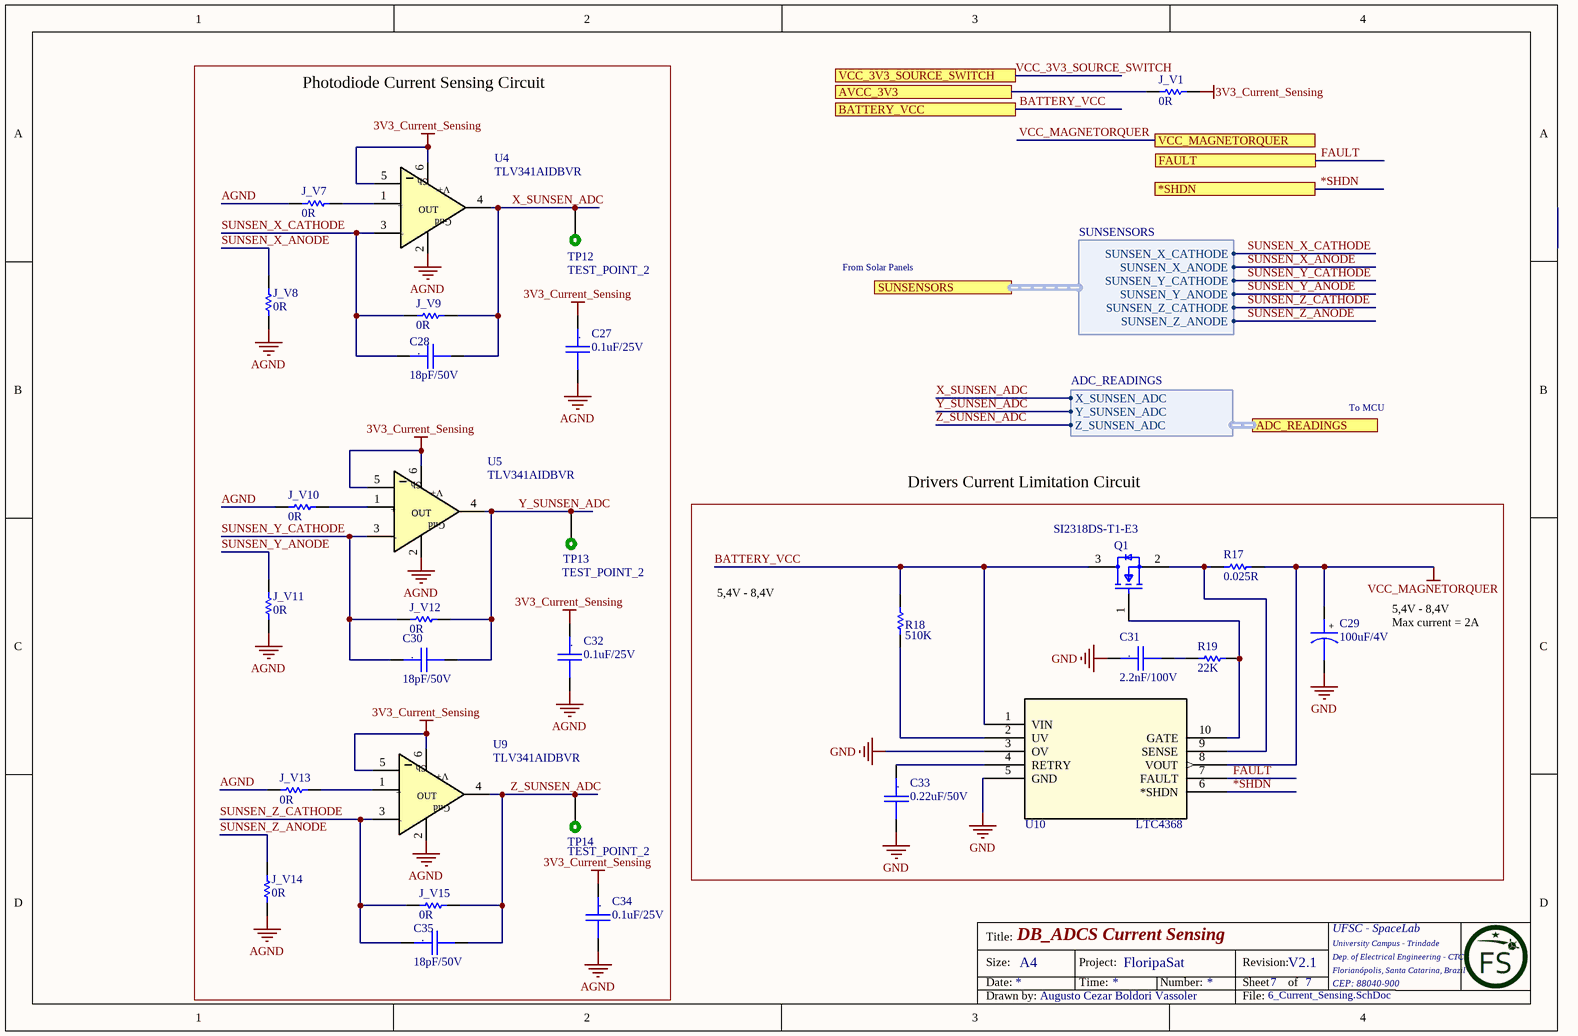
[diagram p4: 6_Current_Sensing.SchDoc]

### Parts
C27  0.1uF/25V  [CC0805]
C28  18pF/50V  [CC0805]
C29  100uF/4V  [CC0805_Tantalum]
C30  18pF/50V  [CC0805]
C31  2.2nF/100V  [CC0805]
C32  0.1uF/25V  [CC0805]
C33  0.22uF/50V  [CC0805]
C34  0.1uF/25V  [CC0805]
C35  18pF/50V  [CC0805]
J_V1  0R  [0805]
J_V7  0R  [0805-LED]
J_V8  0R  [0805-LED]
J_V9  0R  [0805-LED]
J_V10  0R  [0805-LED]
J_V11  0R  [0805-LED]
J_V12  0R  [0805-LED]
J_V13  0R  [0805-LED]
J_V14  0R  [0805-LED]
J_V15  0R  [0805-LED]
Q1  SI2318DS-T1-E3  [FP-S-03946-MFG]
R17  0.025R  [1206]
R18  510K  [0805]
R19  22K  [0805-LED]
TP12  TEST_POINT_2  [TEST_POINT_2]  (no BOM)
TP13  TEST_POINT_2  [TEST_POINT_2]  (no BOM)
TP14  TEST_POINT_2  [TEST_POINT_2]  (no BOM)
U4  TLV341AIDBVR  [SOT-23 6L]
U5  TLV341AIDBVR  [SOT-23 6L]
U9  TLV341AIDBVR  [SOT-23 6L]
U10  LTC4368  [MSOP-10_MS]

### Blocks framed on the sheet
Photodiode Current Sensing Circuit: C27 C28 C30 C32 C34 C35 J_V7-J_V15 TP12-TP14 U4 U5 U9
Drivers Current Limitation Circuit: C29 C31 C33 Q1 R17-R19 U10

### Ports
*SHDN, ADC_READINGS (harness ADC_READINGS), AVCC_3V3, BATTERY_VCC, FAULT, SUNSENSORS (harness SUNSENSORS), VCC_3V3_SOURCE_SWITCH, VCC_MAGNETORQUER

### Harnesses
ADC_READINGS: X_SUNSEN_ADC, Y_SUNSEN_ADC, Z_SUNSEN_ADC
SUNSENSORS: SUNSEN_Z_ANODE, SUNSEN_Z_CATHODE, SUNSEN_Y_ANODE, SUNSEN_Y_CATHODE, SUNSEN_X_ANODE, SUNSEN_X_CATHODE

### Nets
3V3_Current_Sensing: C27.1 C32.1 C34.1 J_V1.1 U4.5(EN) U4.6(V+) U5.5(EN) U5.6(V+) U9.5(EN) U9.6(V+)
AGND: C27.2 C32.2 C34.2 J_V7.2 J_V8.1 J_V10.2 J_V11.2 J_V13.2 J_V14.2 U4.2(Gnd) U5.2(Gnd) U9.2(Gnd)
GND: C29.2 C31.1 C33.2 U10.3(OV) U10.5(GND)
VCC_MAGNETORQUER: C29.1 R17.1 U10.8(VOUT) ; port VCC_MAGNETORQUER
*SHDN: U10.6(*SHDN) ; port *SHDN
AVCC_3V3: J_V1.2 ; port AVCC_3V3
BATTERY_VCC: Q1.3(D) R18.1 U10.1(VIN) ; port BATTERY_VCC
FAULT: U10.7(FAULT) ; port FAULT
SUNSEN_X_ANODE: J_V8.2 ; port SUNSENSORS.SUNSEN_X_ANODE
SUNSEN_X_CATHODE: C28.1 J_V9.2 U4.3(-IN) ; port SUNSENSORS.SUNSEN_X_CATHODE
SUNSEN_Y_ANODE: J_V11.1 ; port SUNSENSORS.SUNSEN_Y_ANODE
SUNSEN_Y_CATHODE: C30.1 J_V12.2 U5.3(-IN) ; port SUNSENSORS.SUNSEN_Y_CATHODE
SUNSEN_Z_ANODE: J_V14.1 ; port SUNSENSORS.SUNSEN_Z_ANODE
SUNSEN_Z_CATHODE: C35.1 J_V15.2 U9.3(-IN) ; port SUNSENSORS.SUNSEN_Z_CATHODE
VCC_3V3_SOURCE_SWITCH: port VCC_3V3_SOURCE_SWITCH
X_SUNSEN_ADC: C28.2 J_V9.1 TP12.1 U4.4(OUT) ; port ADC_READINGS.X_SUNSEN_ADC
Y_SUNSEN_ADC: C30.2 J_V12.1 TP13.1 U5.4(OUT) ; port ADC_READINGS.Y_SUNSEN_ADC
Z_SUNSEN_ADC: C35.2 J_V15.1 TP14.1 U9.4(OUT) ; port ADC_READINGS.Z_SUNSEN_ADC
NetC31_2: C31.2 R19.2
NetC33_1: C33.1 U10.4(RETRY)
NetJ_V7_1: J_V7.1 U4.1(+IN)
NetJ_V10_1: J_V10.1 U5.1(+IN)
NetJ_V13_1: J_V13.1 U9.1(+IN)
NetQ1_1: Q1.1(G) R19.1 U10.10(GATE)
NetQ1_2: Q1.2(S) R17.2 U10.9(SENSE)
NetR18_2: R18.2 U10.2(UV)

### Notes on the sheet
- From Solar Panels
- To MCU
- 5,4V - 8,4V
- 5,4V - 8,4V                                                                                                                     Max current = 2A
- Title:
- Size:
- Date:
- A4
- Project:
- Time:
- FloripaSat
- Number:
- Revision:
- Sheet
- of
- UFSC - SpaceLab
- University Campus - Trindade
- Dep. of Electrical Engineering - CTC
- Florianópolis, Santa Catarina, Brazil
- CEP: 88040-900
- Drawn by:
- File:
- (in symbol Cap_Cer_X7R_0.1uF_25V_0805) .
- (in symbol Cap_Cer_X7R_0.22uF_0805) .
- (in symbol Cap_Cer_X7R_0.0022uF_0805) .
- (in symbol Cap_Cer_X7R_18pF_50V_0805) .
- (in symbol Cap_Tant_SMD_100uF_4V_0805) +
- (in symbol TLV341AIDBVR) Sh; +; -

### Library data of the parts
C27 C32 C34 = Cap_Cer_X7R_0.1uF_25V_0805: as C15 on sheet 4_IMU; NCM: 8532.24.10
C28 C30 C35 = Cap_Cer_X7R_18pF_50V_0805: CAP CER 18pF 50V 5% X7R 0805; Partnumber: CC0805JRNPO9BN180; NCM: 8532.24.10
C29 = Cap_Tant_SMD_100uF_4V_0805: CAP TANT 100UF 4V 20% 0805; Manufacturer: Kyocera AVX; Manufacturer Part Number: TACR107M004RTA; Dielectric Material: Tantalum; ESR (Equivalent Series Resistance): 5R; Leakage Current: 4uA; Dissipation Factor: 30%; Polarity: Polar; Supplier 1: Digi-Key; Supplier Part Number 1: 478-4755-1-ND; RoHS: Yes; Category: Tantalum Capacitors; Stock 1: 1150; Pricing 1: 1=3,32000, 10=2,68800, 100=2,05280, 500=1,56400, 1000=1,36850 (USD); Mount: Surface Mount; Case/Package: 0805; Number of Pins: 2; Case Code (Metric): 2012; Case Code (Imperial): 0805; Min Operating Temperature: -55°C; Max Operating Temperature: 125°C; Capacitance: 100uF; Tolerance: 20%; Packaging: Tape and Reel; Voltage Rating: 4V; Features: General Purpose; Voltage Rating (DC): 4V; Package Quantity: 1; Termination: SMD/SMT; Length: 2mm; Height: 1.5mm; Width: 0.053inch; Height - Seated (Max): 0.059inch; Depth: 1.35mm; ComponentLink1URL: https://datasheet.ciiva.com/265/tac-265068.pdf?src-supplier=Digi-Key; ComponentLink1Description: https://datasheet.ciiva.com/265/tac-265068.pdf?src-supplier=Digi-Key; ComponentLink2URL: https://datasheet.ciiva.com/12890/tac-12890332.pdf?src-supplier=Mouser; ComponentLink2Description: https://datasheet.ciiva.com/12890/tac-12890332.pdf?src-supplier=Mouser; ComponentLink3URL: https://datasheet.ciiva.com/265/tac-265066.pdf?src-supplier=Digi-Key; ComponentLink3Description: https://datasheet.ciiva.com/265/tac-265066.pdf?src-supplier=Digi-Key; ComponentLink4URL: https://datasheet.ciiva.com/265/tac-265067.pdf?src-supplier=Digi-Key; ComponentLink4Description: https://datasheet.ciiva.com/265/tac-265067.pdf?src-supplier=Digi-Key; ComponentLink5URL: https://datasheet.ciiva.com/11301/tac-11301084.pdf?src-supplier=Avnet; ComponentLink5Description: https://datasheet.ciiva.com/11301/tac-11301084.pdf?src-supplier=Avnet
C31 = Cap_Cer_X7R_0.0022uF_0805: Cap Cer 0.0022uF 100V X7R 5% 0805; Manufacturer: Kyocera AVX; Manufacturer Part Number: 08051C222JAT2A; Dielectric Material: Ceramic; Capacitance: 2.2nF; Dissipation Factor: 2.5%; Insulation Resistance: 100GR; Supplier 1: Digi-Key; Supplier Part Number 1: 478-3746-1-ND; RoHS: Yes; Category: Ceramic Capacitors; Stock 1: 21530; Pricing 1: 1=0,23000, 10=0,15400, 100=0,07790, 500=0,05328, 1000=0,04713 (USD); Mount: Surface Mount; Case/Package: 0805; Number of Pins: 2; Case Code (Metric): 2012; Case Code (Imperial): 0805; Contact Plating: Tin,Matte; Min Operating Temperature: -55°C; Max Operating Temperature: 125°C; Dielectric: X7R; Tolerance: 5%; Packaging: Tape and Reel; Voltage Rating (DC): 100V; Voltage Rating: 100V; Termination: SMD/SMT; Package Quantity: 1; Voltage: 100V; Length: 2.01mm; Height: 0.94mm; Depth: 1.25mm; Width: 0.049inch; Thickness: 0.037inch; Radiation Hardening: No; REACH SVHC: No SVHC; Lead Free: Lead Free; ComponentLink1URL: https://datasheet.ciiva.com/11536/cx7r-11536917.pdf?src-supplier=Avnet; ComponentLink1Description: https://datasheet.ciiva.com/11536/cx7r-11536917.pdf?src-supplier=Avnet; ComponentLink2URL: https://datasheet.ciiva.com/150/cx7r-150872.pdf?src-supplier=Digi-Key; ComponentLink2Description: https://datasheet.ciiva.com/150/cx7r-150872.pdf?src-supplier=Digi-Key; ComponentLink3URL: https://datasheet.ciiva.com/150/cx7r-150873.pdf?src-supplier=Digi-Key; ComponentLink3Description: https://datasheet.ciiva.com/150/cx7r-150873.pdf?src-supplier=Digi-Key; ComponentLink4URL: https://datasheet.ciiva.com/150/cx7r-150874.pdf?src-supplier=Digi-Key; ComponentLink4Description: https://datasheet.ciiva.com/150/cx7r-150874.pdf?src-supplier=Digi-Key; ComponentLink5URL: https://datasheet.ciiva.com/7811/cx7r-7811933.pdf?src-supplier=Element14; ComponentLink5Description: https://datasheet.ciiva.com/7811/cx7r-7811933.pdf?src-supplier=Element14; ComponentLink6URL: https://datasheet.ciiva.com/7811/cx7r-7811934.pdf?src-supplier=Element14; ComponentLink6Description: https://datasheet.ciiva.com/7811/cx7r-7811934.pdf?src-supplier=Element14; ComponentLink7URL: https://datasheet.ciiva.com/7811/cx7r-7811935.pdf?src-supplier=Element14; ComponentLink7Description: https://datasheet.ciiva.com/7811/cx7r-7811935.pdf?src-supplier=Element14
C33 = Cap_Cer_X7R_0.22uF_0805: as C19 on sheet 4_IMU; Supplier 1: Digi-Key; Supplier Part Number 1: 399-3491-1-ND; RoHS: Yes; Category: Ceramic Capacitors; Stock 1: 1491563; Pricing 1: 1=0,20000, 10=0,13900, 100=0,06550, 500=0,04592, 1000=0,03802 (USD); Mount: Surface Mount,PCB; Case/Package: 0805; Case Code (Metric): 2012; Case Code (Imperial): 0805; Min Operating Temperature: -55°C; Max Operating Temperature: 125°C; Packaging: Tape and Reel; Dielectric: X7R; Package Quantity: 1; Voltage Rating: 50V; Voltage Rating (DC): 50V; Termination: SMD/SMT; Voltage: 50V; Length: 2mm; Height: 1.1mm; Depth: 1.25mm; Width: 0.049inch; Thickness: 0.055inch; Lead Pitch: 0.75mm; Radiation Hardening: No; REACH SVHC: No SVHC; ComponentLink1URL: https://datasheet.ciiva.com/7842/kem-c1002-x7r-smd-7842582.pdf?src-supplier=Element14; ComponentLink1Description: https://datasheet.ciiva.com/7842/kem-c1002-x7r-smd-7842582.pdf?src-supplier=Element14; ComponentLink2URL: https://datasheet.ciiva.com/18193/getdatasheetpartid-304413-18193686.pdf?src-supplier=Verical; ComponentLink2Description: https://datasheet.ciiva.com/18193/getdatasheetpartid-304413-18193686.pdf?src-supplier=Verical; ComponentLink3URL: https://datasheet.ciiva.com/14589/70095383-14589519.pdf?src-supplier=Allied+Electronics; ComponentLink3Description: https://datasheet.ciiva.com/14589/70095383-14589519.pdf?src-supplier=Allied+Electronics; ComponentLink4URL: https://datasheet.ciiva.com/14603/70095383-14603247.pdf?src-supplier=Allied+Electronics; ComponentLink4Description: https://datasheet.ciiva.com/14603/70095383-14603247.pdf?src-supplier=Allied+Electronics; ComponentLink5URL: https://datasheet.ciiva.com/28682/1851736-28682316.pdf?src-supplier=Element14; ComponentLink5Description: https://datasheet.ciiva.com/28682/1851736-28682316.pdf?src-supplier=Element14
J_V1 J_V7-J_V15 = R0R_JUMPER_1/16W_0805: as J_V4 on sheet 4_IMU; NCM: 8533.21.20
Q1 = CMP-02550-000015-1: MOSFET N-CH 40V 3A SOT23-3; Manufacturer: Vishay; Input Capacitace At Vds: 540pF @ 20V; Turn On Delay Time: 5ns; Standoff Height: 0.01mm; Rthja Max: 120°C/W; Power Dissipation: 0.75W; Number Of Channels: 1; Max Junction Temp: +150°C; Gate Charge At Vgs: 10nC @ 10V; Pulse Drain Current: 16A; Turn Off Delay Time: 20ns; Threshold Vgs Min: 1V; Depletion Mode: False; Max Forward Diode Voltage: 1.2V; Drain To Source Resistance: 0.036Ω; Gate To Source Voltage: 20V; Transconductance: 11S; Threshold Vgs Max: 3V; Typ Forward Diode Voltage: 0.8V; Lead Free: Yes; Temperature Range Low: -55°C; Drain To Source Voltage: 40V; Category: Trans; Number Of N Channels: 1; Temperature Range High: +150°C; RoHS: TRUE; Digikey Description: MOSFET N-CH 40V 3A SOT23-3; Mouser Description: MOSFET 40V 6A; Manufacturer Part Number: SI2318DS-T1-E3; Drain To Source Breakdown Voltage: 40V; ComponentLink2Description: Datasheet; Device Class L1: Discrete Semiconductors; Temperature: -55°C to +150°C; Automotive: No; Package: S-03946; Device Class L3: MOSFETs; Height: 1.12mm; Octopart: https://octopart.com/si2318ds-t1-e3-vishay-40866469; Continuous Drain Current: 3A; Device Class L2: Transistors; ComponentLink2URL: http://www.vishay.com/docs/72322/72322.pdf
R17 = R0.025_1%_1/4W_1206: RES 0.025 OHM - 0.25W 1% 1206; Manufacturer: Vishay Dale; Manufacturer Part Number: WSL1206R0250FBA; Resistance: 25mR; Power Rating: 250mW; Temperature Coefficient: 75ppm/°C; Supplier 1: Avnet; Supplier Part Number 1: WSL1206R0250FBA; RoHS: Yes; Category: Chip SMD Resistors; Pricing 1: 100=0,46579, 200=0,42600, 400=0,30800, 600=0,29920, 800=0,29260 (USD); Case/Package: 1206; Contact Plating: Tin,Lead; Case Code (Imperial): 1206; Case Code (Metric): 3216; Min Operating Temperature: -65°C; Max Operating Temperature: 170°C; Packaging: Bulk; Tolerance: 1%; Composition: Metal Strip; Termination: SMD/SMT; Package Quantity: 100; Length: 3.2mm; Height: 0.635mm; Width: 1.6mm; Radiation Hardening: No; Lead Free: Lead Free; ComponentLink1URL: https://datasheet.ciiva.com/9024/wsl-9024860.pdf?src-supplier=Avnet; ComponentLink1Description: https://datasheet.ciiva.com/9024/wsl-9024860.pdf?src-supplier=Avnet
R18 = R510K_1%_1/8W_0805: RES 510K OHM 1/8W 1% 0805; Manufacturer: Vishay; Manufacturer Part Number: CRCW0805510KFKEA; Resistance: 510kR; Temperature Coefficient: 100ppm/°C; Power Rating: 125mW; Voltage Rating: 150V; Supplier 1: Digi-Key; Supplier Part Number 1: 541-510KCCT-ND; RoHS: Yes; Category: Chip SMD Resistors; Stock 1: 12876; Pricing 1: 1=0,10000, 10=0,06200, 100=0,02540, 1000=0,01142, 2500=0,00991 (USD); Mount: Surface Mount; Case/Package: 0805; Number of Pins: 2; Weight: 0.000194oz; Case Code (Imperial): 0805; Case Code (Metric): 2012; Contact Plating: Tin; Min Operating Temperature: -55°C; Max Operating Temperature: 155°C; Tolerance: 1%; Packaging: Tape and Reel; Composition: Thick Film; Package Quantity: 10; Voltage Rating (DC): 150V; Max Power Dissipation: 125mW; Number of Terminations: 2; Termination: SMD/SMT; Features: Automotive AEC-Q200; Military Standard: Not; Length: 2mm; Height: 0.45mm; Width: 1.25mm; Depth: 1.25mm; Radiation Hardening: No; Lead Free: Lead Free; REACH SVHC: Unknown; ComponentLink1URL: https://datasheet.ciiva.com/11809/0900766b80d98b26-11809600.pdf?src-supplier=RSComponents; ComponentLink1Description: https://datasheet.ciiva.com/11809/0900766b80d98b26-11809600.pdf?src-supplier=RSComponents; ComponentLink2URL: https://datasheet.ciiva.com/7726/dcrcwe3-7726005.pdf?src-supplier=Element14; ComponentLink2Description: https://datasheet.ciiva.com/7726/dcrcwe3-7726005.pdf?src-supplier=Element14; ComponentLink3URL: https://datasheet.ciiva.com/16500/dcrcwe3-16500877.pdf?src-supplier=Future+Electronics; ComponentLink3Description: https://datasheet.ciiva.com/16500/dcrcwe3-16500877.pdf?src-supplier=Future+Electronics; ComponentLink4URL: https://datasheet.ciiva.com/16852/dcrcwe3-16852381.pdf?src-supplier=Avnet+Europe; ComponentLink4Description: https://datasheet.ciiva.com/16852/dcrcwe3-16852381.pdf?src-supplier=Avnet+Europe; ComponentLink5URL: https://datasheet.ciiva.com/2467/dcrcwe3-2467631.pdf?src-supplier=Digi-Key; ComponentLink5Description: https://datasheet.ciiva.com/2467/dcrcwe3-2467631.pdf?src-supplier=Digi-Key; ComponentLink6URL: https://datasheet.ciiva.com/5542/dcrcwe3-109170-5542150.pdf?src-supplier=Mouser; ComponentLink6Description: https://datasheet.ciiva.com/5542/dcrcwe3-109170-5542150.pdf?src-supplier=Mouser; ComponentLink7URL: https://datasheet.ciiva.com/16778/70201119-16778886.pdf?src-supplier=Allied+Electronics; ComponentLink7Description: https://datasheet.ciiva.com/16778/70201119-16778886.pdf?src-supplier=Allied+Electronics; ComponentLink8URL: https://datasheet.ciiva.com/26316/fld-crcw-e3-data-en-26316507.pdf?src-supplier=Distrelec; ComponentLink8Description: https://datasheet.ciiva.com/26316/fld-crcw-e3-data-en-26316507.pdf?src-supplier=Distrelec; ComponentLink9URL: https://datasheet.ciiva.com/2467/dcrcwe3-2467629.pdf?src-supplier=Digi-Key; ComponentLink9Description: https://datasheet.ciiva.com/2467/dcrcwe3-2467629.pdf?src-supplier=Digi-Key; ComponentLink10URL: https://datasheet.ciiva.com/22683/1847332-22683325.pdf?src-supplier=Element14; ComponentLink10Description: https://datasheet.ciiva.com/22683/1847332-22683325.pdf?src-supplier=Element14; ComponentLink11URL: https://datasheet.ciiva.com/2467/dcrcwe3-2467630.pdf?src-supplier=Digi-Key; ComponentLink11Description: https://datasheet.ciiva.com/2467/dcrcwe3-2467630.pdf?src-supplier=Digi-Key; ComponentLink12URL: https://datasheet.ciiva.com/8896/dcrcwe3-8896286.pdf?src-supplier=Avnet; ComponentLink12Description: https://datasheet.ciiva.com/8896/dcrcwe3-8896286.pdf?src-supplier=Avnet
R19 = R22K_1%_1.25W_0805: RES 22K OHM 1.25W 1% 0805; Manufacturer: Vishay; Manufacturer Part Number: CRCW080522K0FKEA; Resistance: 22kR; Power Rating: 125mW; Voltage Rating: 150V; Temperature Coefficient: 100ppm/°C; Supplier 1: Digi-Key; Supplier Part Number 1: 541-22.0KCCT-ND; RoHS: Yes; Category: Chip SMD Resistors; Stock 1: 4249; Pricing 1: 1=0,10000, 10=0,06200, 100=0,02540, 1000=0,01142, 2500=0,00991 (USD); Mount: Surface Mount; Case/Package: 0805; Weight: 0.000194oz; Case Code (Metric): 2012; Case Code (Imperial): 0805; Contact Plating: Tin; Min Operating Temperature: -55°C; Max Operating Temperature: 155°C; Tolerance: 1%; Packaging: Tape and Reel; Composition: Thick Film; Number of Terminations: 2; Termination: SMD/SMT; Military Standard: Not; Package Quantity: 10; Max Power Dissipation: 125mW; Voltage Rating (DC): 150V; Features: Automotive AEC-Q200; Length: 2mm; Height: 0.45mm; Depth: 1.25mm; Width: 0.049inch; Radiation Hardening: No; REACH SVHC: Unknown; Lead Free: Lead Free; ComponentLink1URL: https://datasheet.ciiva.com/7673/1720486-7673152.pdf?src-supplier=Element14; ComponentLink1Description: https://datasheet.ciiva.com/7673/1720486-7673152.pdf?src-supplier=Element14; ComponentLink2URL: https://datasheet.ciiva.com/11808/0900766b80d98b26-11808659.pdf?src-supplier=RSComponents; ComponentLink2Description: https://datasheet.ciiva.com/11808/0900766b80d98b26-11808659.pdf?src-supplier=RSComponents; ComponentLink3URL: https://datasheet.ciiva.com/2514/dcrcwe3-2514289.pdf?src-supplier=Digi-Key; ComponentLink3Description: https://datasheet.ciiva.com/2514/dcrcwe3-2514289.pdf?src-supplier=Digi-Key; ComponentLink4URL: https://datasheet.ciiva.com/2514/dcrcwe3-2514290.pdf?src-supplier=Digi-Key; ComponentLink4Description: https://datasheet.ciiva.com/2514/dcrcwe3-2514290.pdf?src-supplier=Digi-Key; ComponentLink5URL: https://datasheet.ciiva.com/2514/dcrcwe3-2514291.pdf?src-supplier=Digi-Key; ComponentLink5Description: https://datasheet.ciiva.com/2514/dcrcwe3-2514291.pdf?src-supplier=Digi-Key; ComponentLink6URL: https://datasheet.ciiva.com/7672/1697337-7672966.pdf?src-supplier=Element14; ComponentLink6Description: https://datasheet.ciiva.com/7672/1697337-7672966.pdf?src-supplier=Element14; ComponentLink7URL: https://datasheet.ciiva.com/16852/dcrcwe3-16852982.pdf?src-supplier=Avnet+Europe; ComponentLink7Description: https://datasheet.ciiva.com/16852/dcrcwe3-16852982.pdf?src-supplier=Avnet+Europe; ComponentLink8URL: https://datasheet.ciiva.com/5548/dcrcwe3-109170-5548344.pdf?src-supplier=Mouser; ComponentLink8Description: https://datasheet.ciiva.com/5548/dcrcwe3-109170-5548344.pdf?src-supplier=Mouser; ComponentLink9URL: https://datasheet.ciiva.com/26317/fld-crcw-e3-data-en-26317161.pdf?src-supplier=Distrelec; ComponentLink9Description: https://datasheet.ciiva.com/26317/fld-crcw-e3-data-en-26317161.pdf?src-supplier=Distrelec; ComponentLink10URL: https://datasheet.ciiva.com/3258/dcrcwe3-3258332.pdf?src-supplier=Avnet; ComponentLink10Description: https://datasheet.ciiva.com/3258/dcrcwe3-3258332.pdf?src-supplier=Avnet; ComponentLink11URL: https://datasheet.ciiva.com/3258/dcrcwe3-3258333.pdf?src-supplier=Avnet; ComponentLink11Description: https://datasheet.ciiva.com/3258/dcrcwe3-3258333.pdf?src-supplier=Avnet; ComponentLink12URL: https://datasheet.ciiva.com/22676/1847332-22676335.pdf?src-supplier=Element14; ComponentLink12Description: https://datasheet.ciiva.com/22676/1847332-22676335.pdf?src-supplier=Element14
TP12-TP14 = TEST_POINT_2: Test point
U10 = LTC4368: LTC4368 - 100V UV/OV and Reverse Protection Controller with Bidirectional Circuit Breaker; Manufacturer: Analog Devices; Manufacturer Part Number: LTC4368IMS-2#PBF; Supplier 1: Digi-Key; Supplier Part Number 1: LTC4368IMS-2#PBF-ND; Stock 1: 2024; Pricing 1: 1=5,46000, 25=3,13000, 100=2,80800 (USD); Number of Pins: 10; ComponentLink1URL: http://www.linear.com/docs/57622?src-supplier=Digi-Key; ComponentLink1Description: http://www.linear.com/docs/57622?src-supplier=Digi-Key; ComponentLink2URL: http://datasheet.octopart.com/LTC4368IMS-2%23PBF-Linear-Technology-datasheet-78375103.pdf?src-supplier=Newark; ComponentLink2Description: http://datasheet.octopart.com/LTC4368IMS-2%23PBF-Linear-Technology-datasheet-78375103.pdf?src-supplier=Newark; ComponentLink3URL: http://sigma.octopart.com/57693147/technical_drawing/Linear-Technology-LTC4368IMS-2%23PBF.pdf?src-supplier=Linear+Technology; ComponentLink3Description: http://sigma.octopart.com/57693147/technical_drawing/Linear-Technology-LTC4368IMS-2%23PBF.pdf?src-supplier=Linear+Technology
U4 U5 U9 = TLV341AIDBVR: Partnumber: TLV341AIDBVR

## Nets that join several sheets
GND: 0_Architecture (M4.0), 1_Interface (8 pins), 4_IMU (15 pins), 5_Magnetorquer_Drivers (10 pins), 6_Current_Sensing (5 pins)